# EAGLE design 16LEDsPuzzle (EAGLE 7.6.0)
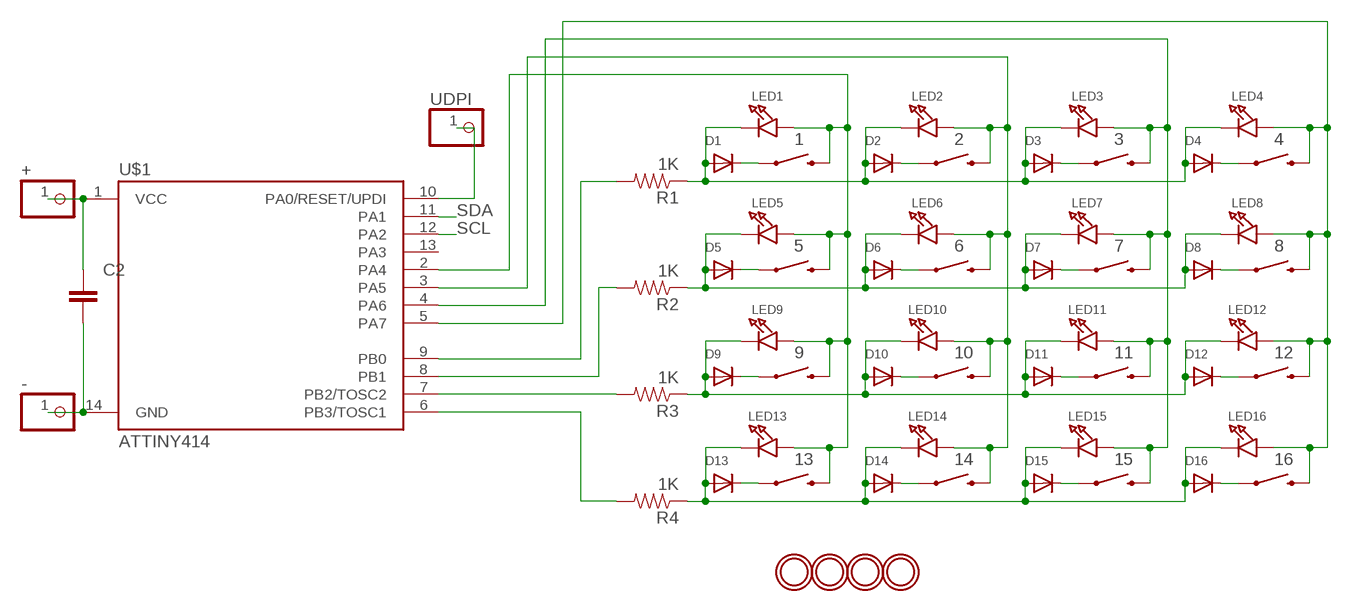
[diagram p0: schematic, sheet 1]

## Parts
1  SWITCH-MOMENTARY-2SMD-4  [TACTILE_SWITCH_TALL]
2  SWITCH-MOMENTARY-2SMD-4  [TACTILE_SWITCH_TALL]
3  SWITCH-MOMENTARY-2SMD-4  [TACTILE_SWITCH_TALL]
4  SWITCH-MOMENTARY-2SMD-4  [TACTILE_SWITCH_TALL]
5  SWITCH-MOMENTARY-2SMD-4  [TACTILE_SWITCH_TALL]
6  SWITCH-MOMENTARY-2SMD-4  [TACTILE_SWITCH_TALL]
7  SWITCH-MOMENTARY-2SMD-4  [TACTILE_SWITCH_TALL]
8  SWITCH-MOMENTARY-2SMD-4  [TACTILE_SWITCH_TALL]
9  SWITCH-MOMENTARY-2SMD-4  [TACTILE_SWITCH_TALL]
10  SWITCH-MOMENTARY-2SMD-4  [TACTILE_SWITCH_TALL]
11  SWITCH-MOMENTARY-2SMD-4  [TACTILE_SWITCH_TALL]
12  SWITCH-MOMENTARY-2SMD-4  [TACTILE_SWITCH_TALL]
13  SWITCH-MOMENTARY-2SMD-4  [TACTILE_SWITCH_TALL]
14  SWITCH-MOMENTARY-2SMD-4  [TACTILE_SWITCH_TALL]
15  SWITCH-MOMENTARY-2SMD-4  [TACTILE_SWITCH_TALL]
16  SWITCH-MOMENTARY-2SMD-4  [TACTILE_SWITCH_TALL]
+  HEADER-1X1ROUND  [1X01_ROUND]
-  HEADER-1X1ROUND  [1X01_ROUND]
C2  100n  CAP0805  [0805]
D1  DIODESOD-123  [SOD-123]
D2  DIODESOD-123  [SOD-123]
D3  DIODESOD-123  [SOD-123]
D4  DIODESOD-123  [SOD-123]
D5  DIODESOD-123  [SOD-123]
D6  DIODESOD-123  [SOD-123]
D7  DIODESOD-123  [SOD-123]
D8  DIODESOD-123  [SOD-123]
D9  DIODESOD-123  [SOD-123]
D10  DIODESOD-123  [SOD-123]
D11  DIODESOD-123  [SOD-123]
D12  DIODESOD-123  [SOD-123]
D13  DIODESOD-123  [SOD-123]
D14  DIODESOD-123  [SOD-123]
D15  DIODESOD-123  [SOD-123]
D16  DIODESOD-123  [SOD-123]
LED1  GREEN  LED0805_NOOUTLINE  [CHIPLED_0805_NOOUTLINE]
LED2  GREEN  LED0805_NOOUTLINE  [CHIPLED_0805_NOOUTLINE]
LED3  GREEN  LED0805_NOOUTLINE  [CHIPLED_0805_NOOUTLINE]
LED4  GREEN  LED0805_NOOUTLINE  [CHIPLED_0805_NOOUTLINE]
LED5  GREEN  LED0805_NOOUTLINE  [CHIPLED_0805_NOOUTLINE]
LED6  GREEN  LED0805_NOOUTLINE  [CHIPLED_0805_NOOUTLINE]
LED7  GREEN  LED0805_NOOUTLINE  [CHIPLED_0805_NOOUTLINE]
LED8  GREEN  LED0805_NOOUTLINE  [CHIPLED_0805_NOOUTLINE]
LED9  GREEN  LED0805_NOOUTLINE  [CHIPLED_0805_NOOUTLINE]
LED10  GREEN  LED0805_NOOUTLINE  [CHIPLED_0805_NOOUTLINE]
LED11  GREEN  LED0805_NOOUTLINE  [CHIPLED_0805_NOOUTLINE]
LED12  GREEN  LED0805_NOOUTLINE  [CHIPLED_0805_NOOUTLINE]
LED13  GREEN  LED0805_NOOUTLINE  [CHIPLED_0805_NOOUTLINE]
LED14  GREEN  LED0805_NOOUTLINE  [CHIPLED_0805_NOOUTLINE]
LED15  GREEN  LED0805_NOOUTLINE  [CHIPLED_0805_NOOUTLINE]
LED16  GREEN  LED0805_NOOUTLINE  [CHIPLED_0805_NOOUTLINE]
R1  1K  RESISTOR0805-RES  [0805]
R2  1K  RESISTOR0805-RES  [0805]
R3  1K  RESISTOR0805-RES  [0805]
R4  1K  RESISTOR0805-RES  [0805]
U$1  ATTINY414  [SO14]
U$2  MOUNTINGHOLE2.5  [MOUNTINGHOLE_2.5_PLATED]
U$3  MOUNTINGHOLE2.5  [MOUNTINGHOLE_2.5_PLATED]
U$4  MOUNTINGHOLE2.5  [MOUNTINGHOLE_2.5_PLATED]
U$5  MOUNTINGHOLE2.5  [MOUNTINGHOLE_2.5_PLATED]
UDPI  HEADER-1X1ROUND  [1X01_ROUND]

## Nets
GND: -.1 C2.2 U$1.14(GND)
N$1: R1.2 U$1.9(PB0)
N$2: 1.B2 5.B2 9.B2 13.B2 LED1.A LED5.A LED9.A LED13.A U$1.2(PA4)
N$3: 1.A2 D1.C
N$4: D1.A D2.A D3.A D4.A LED1.C LED2.C LED3.C LED4.C R1.1
N$5: 5.A2 D5.C
N$6: 2.A2 D2.C
N$7: 2.B2 6.B2 10.B2 14.B2 LED2.A LED6.A LED10.A LED14.A U$1.3(PA5)
N$8: D5.A D6.A D7.A D8.A LED5.C LED6.C LED7.C LED8.C R2.1
N$9: 6.A2 D6.C
N$10: 3.A2 D3.C
N$11: R2.2 U$1.8(PB1)
N$12: 3.B2 7.B2 11.B2 15.B2 LED3.A LED7.A LED11.A LED15.A U$1.4(PA6)
N$13: R3.2 U$1.7(PB2/TOSC2)
N$14: 4.A2 D4.C
N$15: 4.B2 8.B2 12.B2 16.B2 LED4.A LED8.A LED12.A LED16.A U$1.5(PA7)
N$16: 7.A2 D7.C
N$17: R4.2 U$1.6(PB3/TOSC1)
N$18: 8.A2 D8.C
N$20: 9.A2 D9.C
N$21: D9.A D10.A D11.A D12.A LED9.C LED10.C LED11.C LED12.C R3.1
N$22: 10.A2 D10.C
N$24: 11.A2 D11.C
N$25: U$1.10(PA0/RESET/UPDI) UDPI.1
N$26: 12.A2 D12.C
N$29: 13.A2 D13.C
N$30: D13.A D14.A D15.A D16.A LED13.C LED14.C LED15.C LED16.C R4.1
N$31: 14.A2 D14.C
N$33: 15.A2 D15.C
N$35: 16.A2 D16.C
SCL: U$1.12(PA2)
SDA: U$1.11(PA1)
VCC: +.1 C2.1 U$1.1(VCC)
Unconnected: U$1.13(PA3)

## Library data of the parts
1-16 = SparkFun-Electromechanical:SWITCH-MOMENTARY-2: Various NO switches- pushbuttons, reed, etc; PROD_ID: SWCH-11966
+ - UDPI = microbuilder:HEADER-1X1: PIN HEADER
C2 = SparkFun-Capacitors:CAP: Capacitor Standard 0603 ceramic capacitor, and 0.1" leaded capacitor.
D1-D16 = microbuilder:DIODE: Diode SMA Model Volts Amps Type Vf Vr Digikey # Notes SSA34-E3 40V 3A Schottky 480mV @ 3A 200uA @ 40V SSA34-E3/61TGITR-ND CDBA120-G 20V 1A Schottky 500mV @ 1A 500uA @ 20V 641-1014-6-ND REEL MBRA210 10V 2A Schottky 350mV @ 2A 700uA @ 10V MBRA210LT3 SOD-123 Model Volts Amps Type Vf Vr Order # Notes BAT54T1G 30V 200mA Schottky 800mV @ 200mA 2uA @ 25V BAT54T1GOSTR-ND B0530W 30V 500mA Schottky 430mV @ 500mA 130uA @ 30V B0530W-FDICT-ND REEL MBR120 1A 20V Schottky 340mV @ 1A MBR120VLSFT1GOSCT-ND SOD-323 Model Volts Amps Type Vf Vr Order # Notes PMEG2005EJ 20V 500mA Schottky 355mV @ 500mA 568-4110-1-ND ZLLS410 10V 570mA Schottky 380mV @ 570mA ZLLS410CT-ND 1N4148WS 75V 150mA Silicon/Simple 1V 1N4148WSFSCT-ND REEL SOD-523 Model Volts Amps Type Vf Vr Order # Notes BAT54XV2 30V 200mA Schottky 0.8V @ 100mA BAT54XV2CT-ND TB751S 30V 30mA Schottky RB751S-40TE61CT-ND SOT23-R/W (R = Solder Paste/Reflow Ovens, W = Hand-Soldering) Model Volts Amps Type Vf Vr Order # Notes BAT54FILM 40V 300mA Schottky 497-7162-1-ND
LED1-LED16 = microbuilder:LED: LED 0603 - 0603 Surface Mount Package 2mA: Green LED - Low Power (3.9mcd, 2ma, 1.7Vf) - Digikey: 475-2709-2-ND Orange LED - Low Power (9.8mcd, 2ma, 1.8Vf) - Digikey: 475-1194-2-ND Red LED - Low Power (5mcd, 2ma, 1.8Vf) - Digikey: 475-1195-2-ND Yellow LED - Low Power (7mcd, 2ma, 1.8Vf) - Digikey: 475-1196-2-ND 5mA: Blue LED - Low Power (17mcd, 5ma, 2.9Vf) - Digikey: LNJ937W8CRACT-ND 0805 - 0805 Surface Mount Package 2mA: Red LED (8.8mcd, 2mA, 1.8Vf, Clear) - Low Power [Digikey: 475-2510-1-ND] Green LED (5mcd, 2mA, 1.8Vf, Clear) - Low Power [Digikey: 475-2730-1-ND] Yellow LED (11.3mcd, 2mA, 1.8Vf, Clear) - Low Power [Digikey: 475-2555-1-ND] 20mA: Red LED (104mcd, 20mA, Diffused) - LS R976 [Digikey: 475-1278-6-ND] Red LED (12mcd, 20mA, 2.0Vf, Clear) - APT2012EC [Digikey: 754-1128-1-ND] Green LED (15mcd, 20mA, 2.2Vf, Clear) - APT2012GC [Digikey: 754-1131-1-ND] Orange LED (160mcd, 20mA, 2.1Vf, Clear) - APT2012SECK [Digikey: 754-1130-1-ND] 1206 - 1206 Surface Mount Package Green LED (26mcd, 20mA, Diffused) - LG N971 [Digikey: 475-1407-6-ND] Red LED (15mcd, 20mA, Diffused) - LH N974 [Digikey: 475-1416-6-ND] Cree - Cree High-Power Surface Mount LEDs XPEBWT-L1-0000-00D50 - White 111lm 350mA 2.9Vf 6200K 110° XTEAWT-00-0000-00000LEE3 - White 114lm 350mA 2.85Vf 5000K 115° Everlight - Everlight 45-21 Series Surface Mount LEDs 45-21/QK2C-B2832AC2CB2/2T - Warm White 2000mcd 20mA 3.25Vf 3050K 120° 45-21/LK2C-B38452C4CB2/2T - Nuetral White 2000mcd 20mA 3.25Vf 4150K 120° 45-21/LK2C-B50634C6CB2/2T - Cold White 2200mcd 20mA 3.25Vf 5650K 120° PLCC2 Reverse Mount LS T77K-J1L2-1-0-2-R18-Z - Red 11.25mcd 2mA 1.8Vf 630nm 120° LO T77K-L1M2-24-Z - Orange 19.6mcd 2mA 1.8Vf 606nm 120° LY T77K-K2M1-26-Z - Yellow 15.7mcd 2mA 1.8Vf 587nm 120°
R1-R4 = SparkFun-Resistors:RESISTOR: Resistor Basic schematic elements and footprints for 0603, 1206, and PTH resistors.
U$1 = technoblogy:ATTINY414: Atmel 14-pin 2/4/8kB flash uC; PROD_ID: IC-11285
U$2-U$5 = microbuilder:MOUNTINGHOLE: Mounting Hole For #2 screws (0.086"/2.18mm width, 0.094"/2.4mm hole) use 2.5mm; BOM: EXCLUDE

## Board
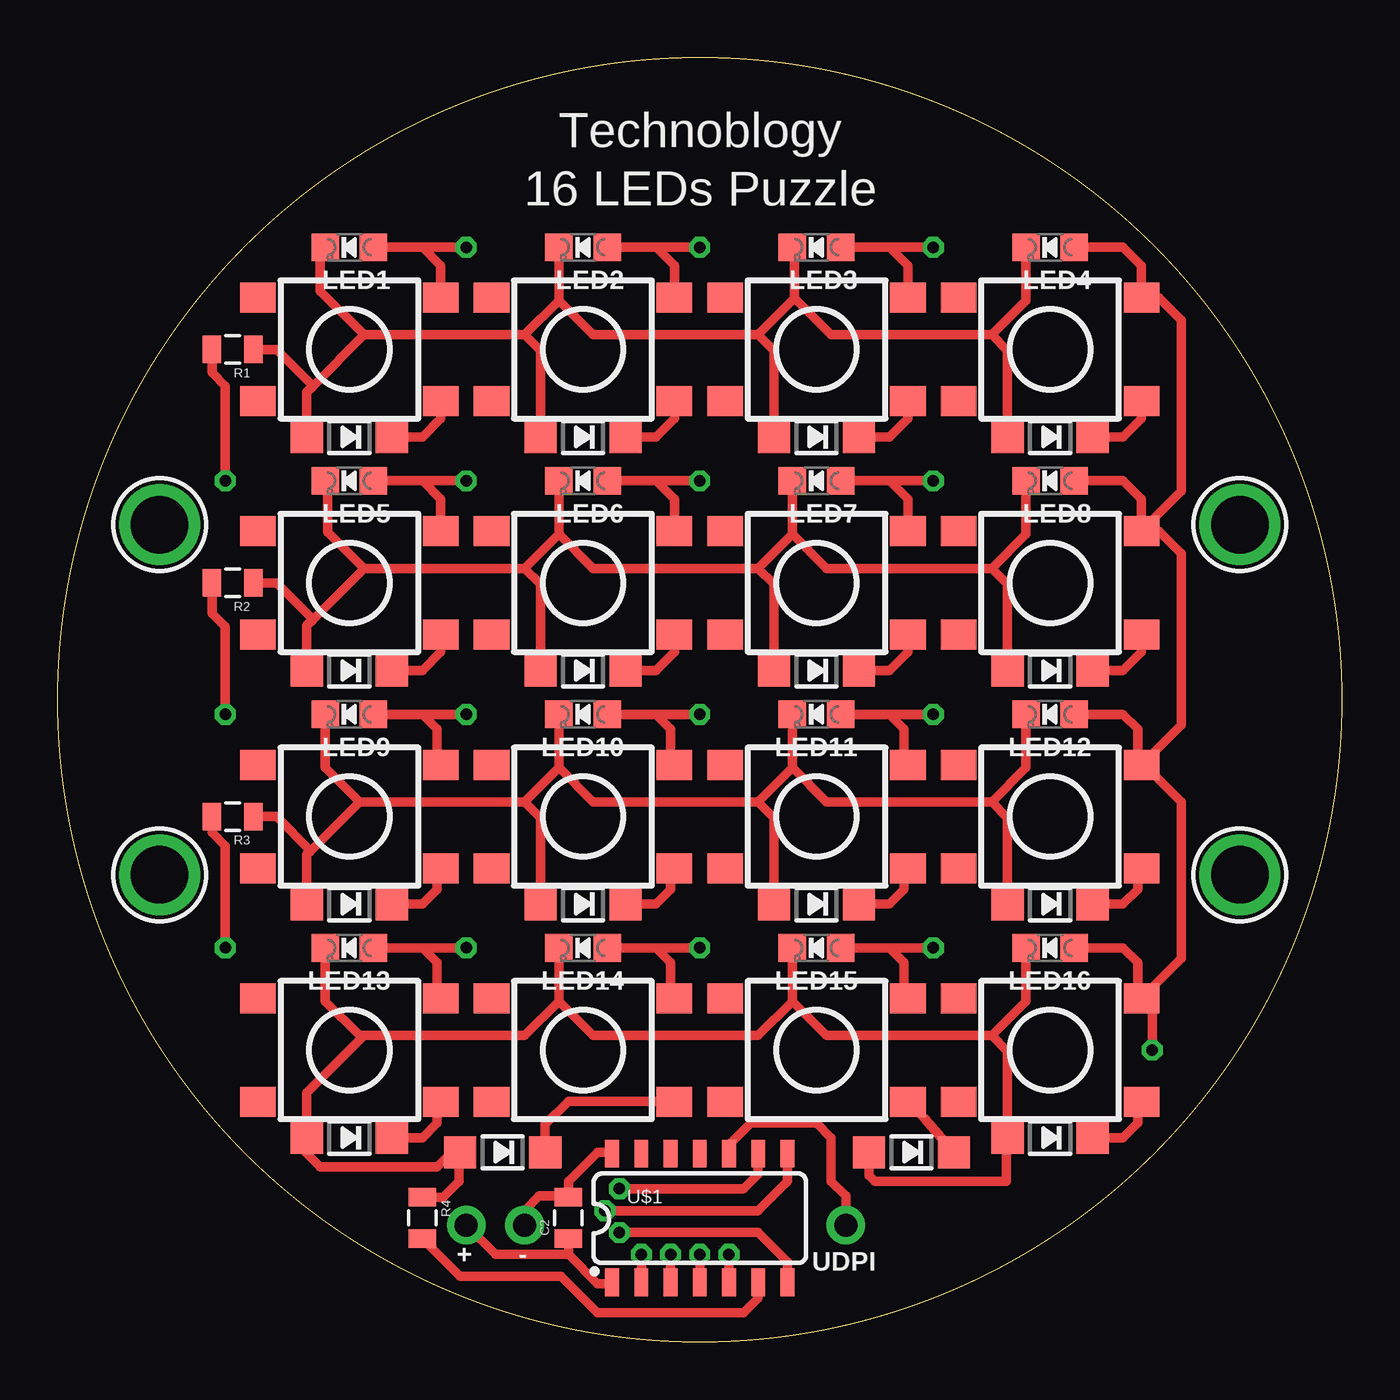
[diagram p1: board, top side]
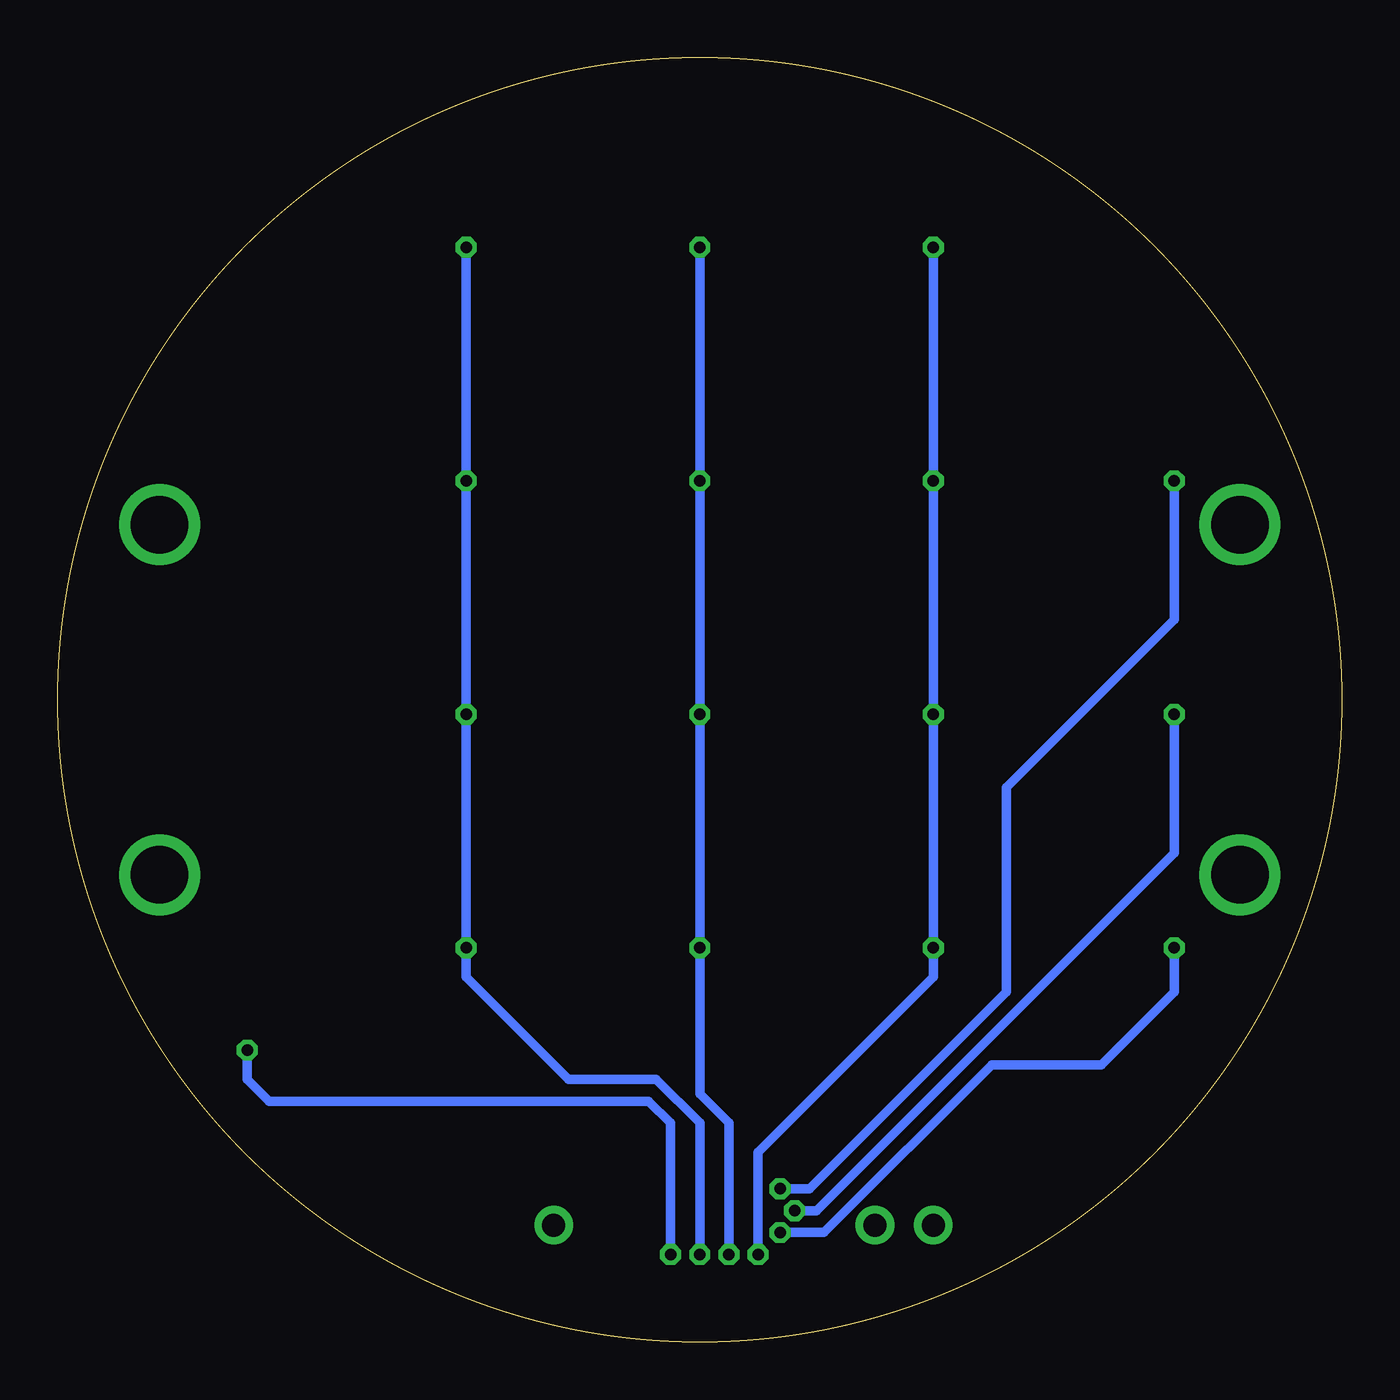
[diagram p2: board, bottom side, seen from below]

Size 55.88 x 55.88 mm. Coordinates in mm from the lower left corner, seen from the top.
Outline: circle at 27.94,27.94 radius 27.94
Copper layers (1*16): Top 0.035mm / dielectric 1.5mm / Bottom 0.035mm
Design rules "default *": minimum track width 10mil, minimum drill 15.5mil, track to track 8mil, track to pad 8mil, pad to pad 8mil, via to via 8mil, smd to smd 8mil, copper to edge 40mil, drill to drill 8mil, minimum pad ring 10mil, minimum via ring 8mil, stop-mask expansion 4mil, vias tented up to drill 20mil, thermal gap 10mil

### Footprints (pad centres in the part's own frame; a part is rotated, then mirrored left to right if it is on the bottom)
TACTILE_SWITCH_TALL = smd 1.55 x 1.3: A1 -3.975,-2.25; A2 3.975,-2.25; B1 -3.975,2.25; B2 3.975,2.25
1X01_ROUND = drill 1 pad 1.676: 1 0,0
0805 = smd 0.8 x 1.2: 1 -0.9,0; 2 0.9,0
SOD-123 = smd 1.4 x 1.4: A 1.85,0; C -1.85,0
CHIPLED_0805_NOOUTLINE = smd 1.2 x 1.2: A 0,-1.05; C 0,1.05
SO14 = smd 0.6 x 1.2: 1 -3.81,-2.8; 2 -2.54,-2.8; 3 -1.27,-2.8; 4 0,-2.8; 5 1.27,-2.8; 6 2.54,-2.8; 7 3.81,-2.8; 8 3.81,2.8; 9 2.54,2.8; 10 1.27,2.8; 11 0,2.8; 12 -1.27,2.8; 13 -2.54,2.8; 14 -3.81,2.8
MOUNTINGHOLE_2.5_PLATED = drill 2.5 pad 3.2: P$1 0,0

### Placement (x,y rotation side)
1  12.7,43.18 0 top
2  22.86,43.18 0 top
3  33.02,43.18 0 top
4  43.18,43.18 0 top
5  12.7,33.02 0 top
6  22.86,33.02 0 top
7  33.02,33.02 0 top
8  43.18,33.02 0 top
9  12.7,22.86 0 top
10  22.86,22.86 0 top
11  33.02,22.86 0 top
12  43.18,22.86 0 top
13  12.7,12.7 0 top
14  22.86,12.7 0 top
15  33.02,12.7 0 top
16  43.18,12.7 0 top
+  17.78,5.08 0 top
-  20.32,5.08 0 top
C2  22.23,5.4 90 top
D1  12.7,39.37 180 top
D2  22.86,39.37 180 top
D3  33.02,39.37 180 top
D4  43.18,39.37 180 top
D5  12.7,29.21 180 top
D6  22.86,29.21 180 top
D7  33.02,29.21 180 top
D8  43.18,29.21 180 top
D9  12.7,19.05 180 top
D10  22.86,19.05 180 top
D11  33.02,19.05 180 top
D12  43.18,19.05 180 top
D13  12.7,8.89 180 top
D14  19.37,8.26 180 top
D15  37.15,8.26 180 top
D16  43.18,8.89 180 top
LED1  12.7,47.62 90 top
LED2  22.86,47.62 90 top
LED3  33.02,47.62 90 top
LED4  43.18,47.62 90 top
LED5  12.7,37.47 90 top
LED6  22.86,37.47 90 top
LED7  33.02,37.47 90 top
LED8  43.18,37.47 90 top
LED9  12.7,27.3 90 top
LED10  22.86,27.3 90 top
LED11  33.02,27.3 90 top
LED12  43.18,27.3 90 top
LED13  12.7,17.14 90 top
LED14  22.86,17.14 90 top
LED15  33.02,17.14 90 top
LED16  43.18,17.14 90 top
R1  7.62,43.18 180 top
R2  7.62,33.02 180 top
R3  7.62,22.86 180 top
R4  15.88,5.4 270 top
U$1  27.94,5.4 0 top
U$2  4.45,35.56 0 top
U$3  51.44,35.56 0 top
U$4  4.45,20.32 0 top
U$5  51.44,20.32 0 top
UDPI  34.29,5.08 0 top

### Tracks (layer width: path | path; a pad name or v marks a point on that pad's centre or on a via)
GND
  Top 0.406: U$1.14 24.07,8.26 23.5,8.26 22.23,6.99 C2.2 22.17,6.35 20.95,6.35 20.32,5.71 -.1
N$1  (via drill 0.5)
  Top 0.406: U$1.9 30.48,7.3 29.84,6.67 v24.45,6.67 | R1.2 6.72,42.17 7.3,41.59 v7.3,37.47
  Bottom 0.406: v24.45,6.67 23.18,6.67 14.61,15.24 14.61,24.13 7.3,31.43 v7.3,37.47
N$2  (via drill 0.5)
  Top 0.406: 15.88,47.62 LED1.A | 5.B2 16.68,36.66 15.88,37.47 | 15.88,37.47 LED5.A | 13.B2 16.51,15.12 16.51,16.51 15.88,17.14 LED13.A v17.78,17.14 | LED9.A 15.88,27.3 | 15.88,27.3 16.51,26.67 16.51,25.27 9.B2 | 15.88,27.3 v17.78,27.3 | 15.88,37.47 v17.78,37.47 | 16.68,46.52 1.B2 16.68,46.83 15.88,47.62 | 15.88,47.62 v17.78,47.62 | v25.4,3.81 U$1.2
  Bottom 0.406: v17.78,47.62 v17.78,37.47 v17.78,27.3 v17.78,17.14 17.78,15.88 25.4,8.26 v25.4,3.81
N$3
  Top 0.406: 1.A2 16.68,40.17 15.88,39.37 D1.C
N$4
  Top 0.406: LED4.C 42.13,45.3 40.64,43.81 | LED3.C 32.07,47.53 32.07,45.4 | LED2.C 21.81,45.3 | 21.81,45.3 20.32,43.81 | 11.43,47.41 LED1.C | 32.07,45.4 30.48,43.81 | 30.48,43.81 23.3,43.81 21.81,45.3 | 40.64,43.81 33.66,43.81 32.07,45.4 | D2.A 21.01,43.12 20.32,43.81 | D3.A 31.17,43.12 30.48,43.81 | D4.A 41.33,43.12 40.64,43.81 | 11.43,47.41 11.43,47.62 | 11.43,47.41 11.43,45.72 13.34,43.81 | 20.32,43.81 13.34,43.81 | D1.A 10.85,41.33 11.11,41.59 | 11.11,41.59 13.34,43.81 | R1.1 9.53,43.18 11.11,41.59
N$5
  Top 0.406: 5.A2 16.68,30.01 15.88,29.21 D5.C
N$6
  Top 0.406: 2.A2 26.84,40.17 26.04,39.37 D2.C
N$7  (via drill 0.5)
  Top 0.406: 6.B2 26.84,36.66 26.04,37.47 | 26.04,37.47 LED6.A | LED10.A 26.04,27.3 | 26.04,27.3 26.67,26.67 26.67,25.27 10.B2 | 14.B2 26.67,15.12 26.67,16.51 26.04,17.14 LED14.A v27.94,17.14 | U$1.3 v26.67,3.81 | 26.04,27.3 v27.94,27.3 | 26.04,37.47 v27.94,37.47 | 26.84,46.52 2.B2 26.84,46.83 26.04,47.62 LED2.A v27.94,47.62
  Bottom 0.406: v26.67,3.81 26.67,9.53 27.94,10.79 v27.94,17.14 v27.94,27.3 v27.94,37.47 v27.94,47.62
N$8
  Top 0.406: LED8.C 42.13,35.15 40.64,33.66 | 32.07,37.37 LED7.C 31.97,35.15 | 21.91,37.37 LED6.C 21.81,35.15 | LED5.C 11.75,37.37 11.75,35.24 13.34,33.66 | 31.97,35.15 30.48,33.66 | 21.81,35.15 20.32,33.66 | 40.64,33.66 33.46,33.66 31.97,35.15 | 30.48,33.66 23.3,33.66 21.81,35.15 | 20.32,33.66 13.34,33.66 | D7.A 31.17,32.97 30.48,33.66 | D8.A 41.33,32.97 40.64,33.66 | D6.A 21.01,32.97 20.32,33.66 | D5.A 10.85,31.17 11.11,31.43 | 11.11,31.43 13.34,33.66 | R2.1 9.53,33.02 11.11,31.43
N$9
  Top 0.406: 6.A2 26.84,30.01 26.04,29.21 D6.C
N$10
  Top 0.406: 3.A2 36.99,40.17 36.2,39.37 D3.C
N$11  (via drill 0.5)
  Top 0.406: v23.81,5.71 30.48,5.71 31.75,6.99 U$1.8 | R2.2 6.72,31.7 7.3,31.11 v7.3,27.3
  Bottom 0.406: v23.81,5.71 22.86,5.71 7.3,21.27 v7.3,27.3
N$12  (via drill 0.5)
  Top 0.406: 7.B2 36.99,36.66 36.2,37.47 | 36.2,37.47 LED7.A | 11.B2 36.83,25.27 36.83,26.67 36.2,27.3 LED11.A v38.1,27.3 | 15.B2 36.83,15.12 36.83,16.51 36.2,17.14 LED15.A v38.1,17.14 | U$1.4 v27.94,3.81 | 36.2,37.47 v38.1,37.47 | 36.99,46.52 3.B2 36.99,46.83 36.2,47.62 LED3.A v38.1,47.62
  Bottom 0.406: v27.94,3.81 27.94,9.53 29.84,11.43 33.66,11.43 38.1,15.88 v38.1,17.14 v38.1,27.3 v38.1,37.47 v38.1,47.62
N$13  (via drill 0.5)
  Top 0.406: v24.45,4.76 30.48,4.76 31.75,3.49 U$1.7 | R3.2 6.72,22.17 7.3,21.59 v7.3,17.14
  Bottom 0.406: v24.45,4.76 22.54,4.76 15.24,12.06 10.48,12.06 7.3,15.24 v7.3,17.14
N$14
  Top 0.406: 4.A2 47.16,40.17 46.35,39.37 D4.C
N$15  (via drill 0.5)
  Top 0.406: LED4.A 46.35,47.62 47.16,46.83 4.B2 47.91,45.43 48.9,44.45 48.9,37.01 8.B2 | 8.B2 47.16,36.66 46.35,37.47 LED8.A | LED12.A 46.35,27.3 46.99,26.67 46.99,25.27 12.B2 | LED16.A 46.35,17.14 46.99,16.51 46.99,15.12 16.B2 | 8.B2 47.91,35.27 48.9,34.29 48.9,26.85 12.B2 | 12.B2 47.28,25.11 48.9,23.5 48.9,16.69 16.B2 | U$1.5 v29.21,3.81 | v47.62,12.7 47.62,14.48 16.B2
  Bottom 0.406: v29.21,3.81 29.21,9.53 30.16,10.48 46.67,10.48 47.62,11.43 v47.62,12.7
N$16
  Top 0.406: 7.A2 36.99,30.01 36.2,29.21 D7.C
N$17
  Top 0.406: U$1.6 30.48,1.91 29.84,1.27 23.5,1.27 21.91,2.86 17.52,2.86 R4.2
N$18
  Top 0.406: 8.A2 47.16,30.01 46.35,29.21 D8.C
N$20
  Top 0.406: D9.C 15.88,19.05 16.51,19.68 16.51,20.45 9.A2
N$21
  Top 0.406: LED12.C 42.13,24.98 40.64,23.5 | 40.64,23.5 33.46,23.5 31.97,24.98 | LED11.C 31.97,24.98 | 31.97,24.98 30.48,23.5 | 30.48,23.5 23.3,23.5 21.81,24.98 | LED10.C 21.81,24.98 | 21.81,24.98 20.32,23.5 | 20.32,23.5 13.14,23.5 | LED9.C 11.65,24.98 13.14,23.5 | D12.A 41.33,22.8 40.64,23.5 | D11.A 31.17,22.8 30.48,23.5 | D10.A 21.01,22.8 20.32,23.5 | D9.A 10.85,21.2 11.02,21.37 | 11.02,21.37 13.14,23.5 | R3.1 9.53,22.86 11.02,21.37
N$22
  Top 0.406: D10.C 26.04,19.05 26.67,19.68 26.67,20.45 10.A2
N$24
  Top 0.406: D11.C 36.2,19.05 36.83,19.68 36.83,20.45 11.A2
N$25
  Top 0.406: UDPI.1 34.29,6.35 33.66,6.99 33.66,8.89 33.02,9.53 30.16,9.53 29.21,8.57 U$1.10
N$26
  Top 0.406: D12.C 46.35,19.05 46.99,19.68 46.99,20.45 12.A2
N$29
  Top 0.406: D13.C 15.88,8.89 16.51,9.53 16.51,10.29 13.A2
N$30
  Top 0.406: LED16.C 42.13,14.82 40.64,13.34 | LED15.C 31.97,14.82 | 31.97,14.82 30.48,13.34 23.3,13.34 21.81,14.82 | LED14.C 21.81,14.82 | 21.81,14.82 20.32,13.34 13.34,13.34 | LED13.C 11.65,14.82 13.14,13.34 13.34,13.34 | 40.64,13.34 33.46,13.34 31.97,14.82 | 40.64,13.34 41.33,12.64 D16.A 41.27,8.84 41.27,6.99 35.56,6.99 35.3,7.25 D15.A | 13.34,13.34 10.85,10.85 D13.A 10.79,8.84 10.79,8.26 11.43,7.62 16.51,7.62 17.14,8.26 D14.A 17.46,8.2 17.46,6.99 16.77,6.3 R4.1
N$31
  Top 0.406: D14.C 21.22,9.47 22.23,10.48 26.81,10.48 14.A2
N$33
  Top 0.406: D15.C 37.73,9.72 15.A2
N$35
  Top 0.406: D16.C 46.35,8.89 46.99,9.53 46.99,10.29 16.A2
VCC
  Top 0.406: C2.1 22.23,3.81 | 22.23,3.81 23.5,2.54 24.07,2.54 U$1.1 | +.1 19.05,3.81 22.23,3.81

### Text on the board
tPlace: Technoblogy | 16 LEDs Puzzle